# EAGLE design Roll Swarm (EAGLE 9.6.2)
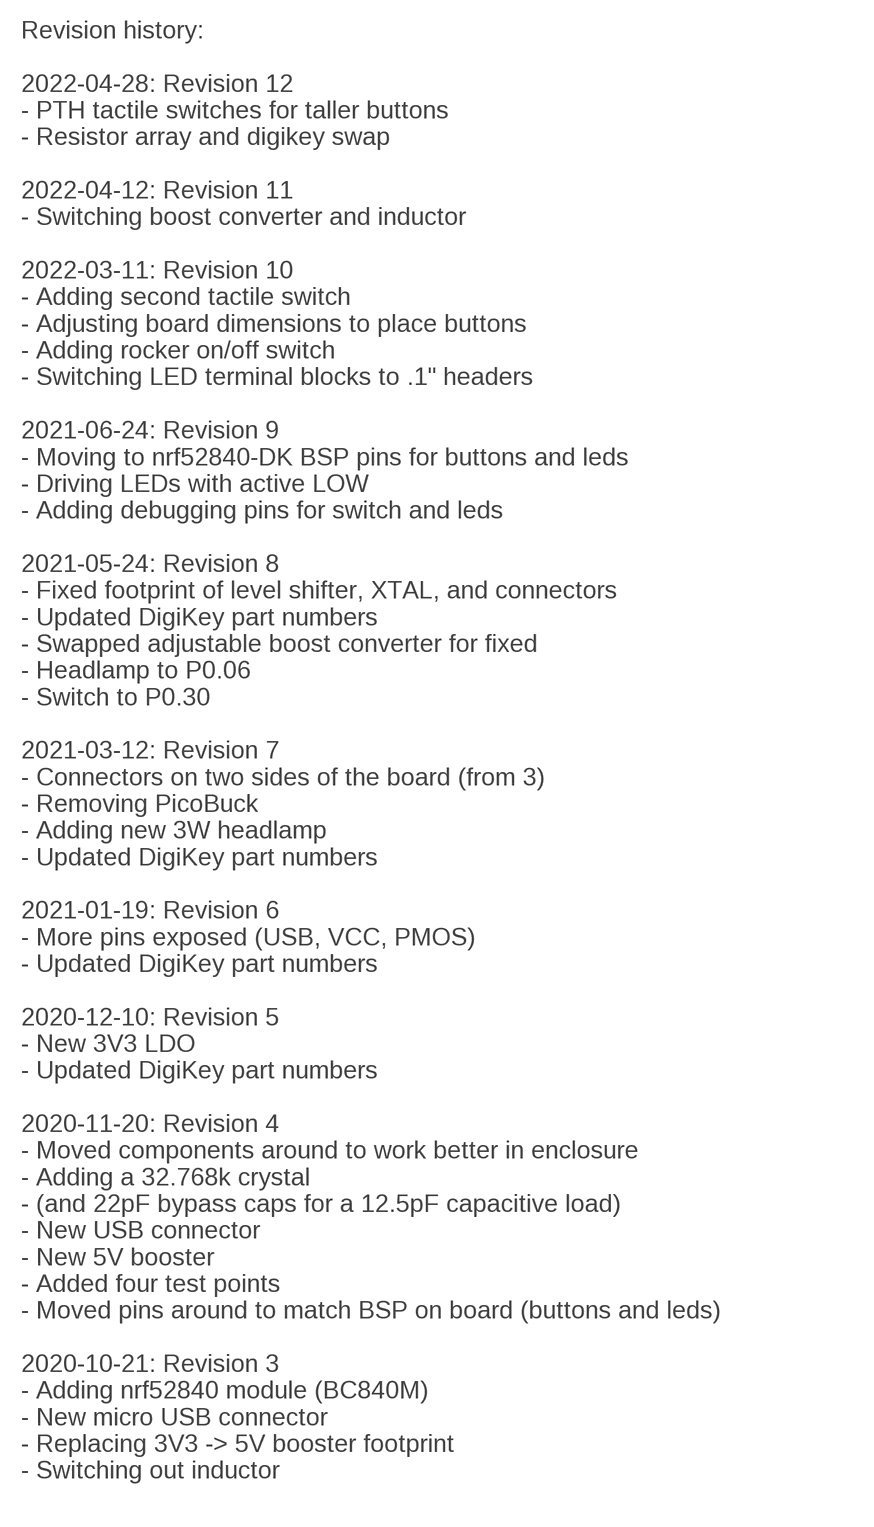
[diagram p0: schematic, sheet 1, part 1 of 2]
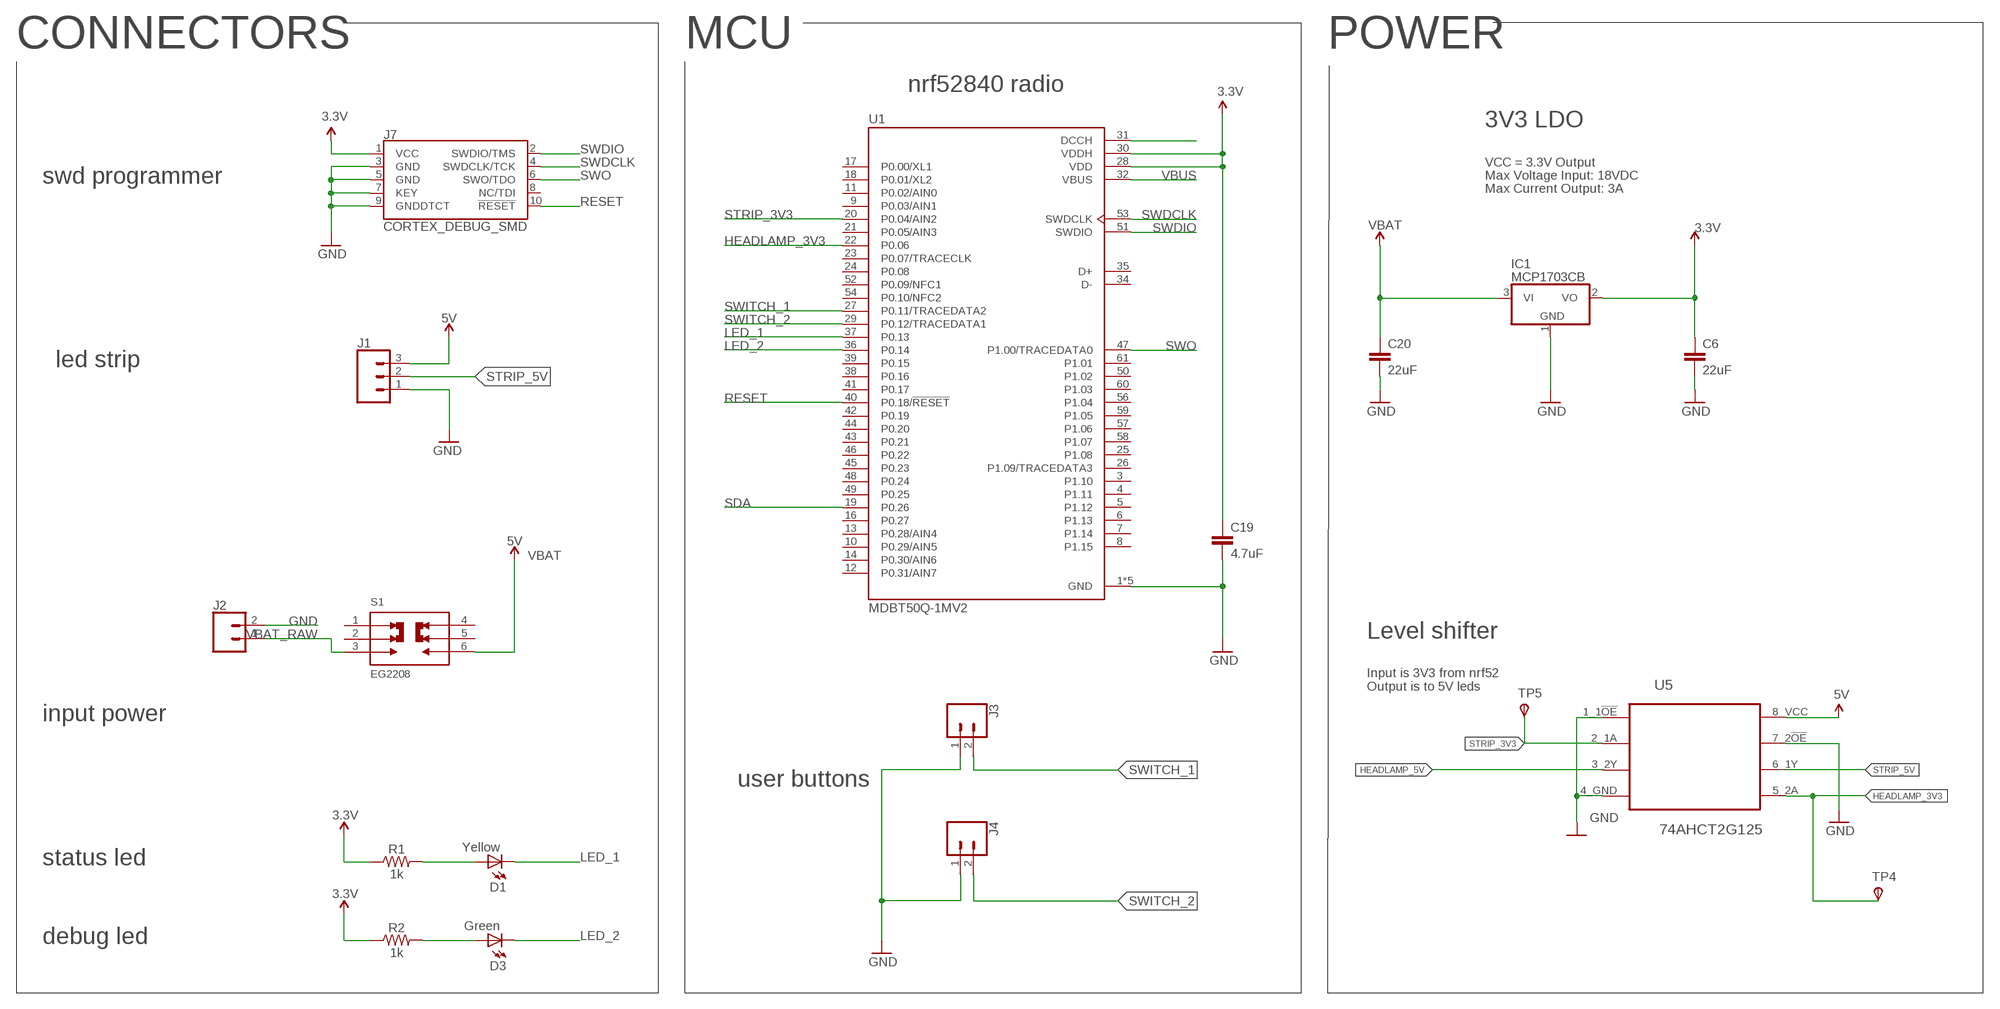
[diagram p1: schematic, sheet 1, part 2 of 2]

## Parts
C6  22uF  22UF-0805-6.3V-20%  [0805]
C19  4.7uF  4.7UF0603  [0603]
C20  22uF  22UF-0805-6.3V-20%  [0805]
D1  Yellow  LED0603  [LED-0603]
D3  Green  LED0603  [LED-0603]
IC1  MCP1703CB  [SOT23]
J1  CONN_03LOCK_LONGPADS  [1X03_LOCK_LONGPADS]
J2  CONN_02LOCK_LONGPADS  [1X02_LOCK_LONGPADS]
J3  CONN_02PTH4  [1X02_XTRA_BIG]
J4  CONN_02PTH4  [1X02_XTRA_BIG]
J7  CORTEX_DEBUG_SMD  [SAMTECH_FTSH-105-01]
R1  1k  1KOHM-0603-1/10W-1%  [0603]
R2  1k  1KOHM-0603-1/10W-1%  [0603]
S1  EG2208  [SW_EG2208]
TP4  TPSB1,27  [B1,27]
TP5  TPSB1,27  [B1,27]
U1  MDBT50Q-1MV2  [XCVR_MDBT50Q-1MV2]
U5  74AHCT2G125  VSSOP-8_DEVICE  [VSSOP-8]

## Nets
3.3V: C6.1 C19.1 IC1.2(VO) J7.1(VCC) R1.1 R2.1 U1.28(VDD) U1.30(VDDH) ; supply symbol labelled VCC
GND: C6.2 C19.2 C20.2 IC1.1(GND) J1.1 J2.2 J3.1 J4.1 J7.3(GND) J7.5(GND) J7.7(KEY) J7.9(GNDDTCT) U1.1(GND) U1.2(GND) U1.15(GND) U1.33(GND) U1.55(GND) U5.1_1!OE U5.4_GND U5.7_2!OE
HEADLAMP_3V3: TP4.TP(PP) U1.22(P0.06) U5.5_2A
HEADLAMP_5V: U5.3_2Y
LED_1: D1.C U1.37(P0.13)
LED_2: D3.C U1.36(P0.14)
N$1: D1.A R1.2
N$5: U1.31(DCCH)
N$8: D3.A R2.2
RESET: J7.10(!RESET) U1.40(P0.18/!RESET)
SDA: U1.19(P0.26)
STRIP_3V3: TP5.TP(PP) U1.20(P0.04/AIN2) U5.2_1A
STRIP_5V: J1.2 U5.6_1Y
SWDCLK: J7.4(SWDCLK/TCK) U1.53(SWDCLK)
SWDIO: J7.2(SWDIO/TMS) U1.51(SWDIO)
SWITCH_1: J3.2 U1.27(P0.11/TRACEDATA2)
SWITCH_2: J4.2 U1.29(P0.12/TRACEDATA1)
SWO: J7.6(SWO/TDO) U1.47(P1.00/TRACEDATA0)
VBAT: C20.1 IC1.3(VI) J1.3 S1.6 U5.8_VCC ; supply symbol labelled 5V
VBAT_RAW: J2.1 S1.3
VBUS: U1.32(VBUS)
Unconnected: J7.8(NC/TDI) S1.1 S1.2 S1.4 S1.5 U1.3(P1.10) U1.4(P1.11) U1.5(P1.12) U1.6(P1.13) U1.7(P1.14) U1.8(P1.15) U1.9(P0.03/AIN1) U1.10(P0.29/AIN5) U1.11(P0.02/AIN0) U1.12(P0.31/AIN7) U1.13(P0.28/AIN4) U1.14(P0.30/AIN6) U1.16(P0.27) U1.17(P0.00/XL1) U1.18(P0.01/XL2) U1.21(P0.05/AIN3) U1.23(P0.07/TRACECLK) U1.24(P0.08) U1.25(P1.08) U1.26(P1.09/TRACEDATA3) U1.34(D-) U1.35(D+) U1.38(P0.16) U1.39(P0.15) U1.41(P0.17) U1.42(P0.19) U1.43(P0.21) U1.44(P0.20) U1.45(P0.23) U1.46(P0.22) U1.48(P0.24) U1.49(P0.25) U1.50(P1.02) U1.52(P0.09/NFC1) U1.54(P0.10/NFC2) U1.56(P1.04) U1.57(P1.06) U1.58(P1.07) U1.59(P1.05) U1.60(P1.03) U1.61(P1.01)

## Notes on the sheet
- Revision history:
  
  2022-04-28: Revision 12
  - PTH tactile switches for taller buttons
  - Resistor array and digikey swap
  
  2022-04-12: Revision 11
  - Switching boost converter and inductor
  
  2022-03-11: Revision 10
  - Adding second tactile switch
  - Adjusting board dimensions to place buttons
  - Adding rocker on/off switch
  - Switching LED terminal blocks to .1" headers
  
  2021-06-24: Revision 9
  - Moving to nrf52840-DK BSP pins for buttons and leds
  - Driving LEDs with active LOW
  - Adding debugging pins for switch and leds
  
  2021-05-24: Revision 8
  - Fixed footprint of level shifter, XTAL, and connectors
  - Updated DigiKey part numbers
  - Swapped adjustable boost converter for fixed
  - Headlamp to P0.06
  - Switch to P0.30
  
  2021-03-12: Revision 7
  - Connectors on two sides of the board (from 3)
  - Removing PicoBuck
  - Adding new 3W headlamp
  - Updated DigiKey part numbers
  
  2021-01-19: Revision 6
  - More pins exposed (USB, VCC, PMOS)
  - Updated DigiKey part numbers
  
  2020-12-10: Revision 5
  - New 3V3 LDO
  - Updated DigiKey part numbers
  
  2020-11-20: Revision 4
  - Moved components around to work better in enclosure
  - Adding a 32.768k crystal 
  - (and 22pF bypass caps for a 12.5pF capacitive load) 
  - New USB connector
  - New 5V booster
  - Added four test points
  - Moved pins around to match BSP on board (buttons and leds)
  
  2020-10-21: Revision 3
  - Adding nrf52840 module (BC840M)
  - New micro USB connector
  - Replacing 3V3 -> 5V booster footprint
  - Switching out inductor
- CONNECTORS | MCU | POWER
- nrf52840 radio
- 3V3 LDO
- swd programmer | VCC = 3.3V Output
- Max Voltage Input: 18VDC
- Max Current Output: 3A
- led strip
- Level shifter
- Input is 3V3 from nrf52
  Output is to 5V leds
- input power
- user buttons
- status led
- debug led

## Library data of the parts
C6 C20 = SparkFun-Capacitors:22UF: 22µF ceramic capacitors A capacitor is a passive two-terminal electrical component used to store electrical energy temporarily in an electric field.; DIGIKEY: 490-10511-1-ND; PROD_ID: CAP-08402
C19 = SparkFun-Capacitors:4.7UF: 4.7µF ceramic capacitors A capacitor is a passive two-terminal electrical component used to store electrical energy temporarily in an electric field.; DIGIKEY: 399-3482-1-ND; PROD_ID: CAP-08280
D1 = SparkFun:LED: LEDs Standard schematic elements and footprints for 5mm, 3mm, 1206, and 0603 sized LEDs. 5mm - Spark Fun Electronics SKU : COM-00529 (and others); DIGIKEY: 350-4349-2-ND
D3 = SparkFun:LED: LEDs Standard schematic elements and footprints for 5mm, 3mm, 1206, and 0603 sized LEDs. 5mm - Spark Fun Electronics SKU : COM-00529 (and others); DIGIKEY: 754-1116-1-ND
IC1 = linear:MCP1703: 250 mA, 16V, Low Quiescent Current LDO Regulator Source: http://ww1.microchip.com/downloads/en/DeviceDoc/22049b.pdf; DIGIKEY: AP2138N-3.3TRG1DICT-ND
J1 = SparkFun-Connectors:CONN_03: Multi connection point. Often used as Generic Header-pin footprint for 0.1 inch spaced/style header connections On any of the 0.1 inch spaced packages, you can populate with these: Break Away Headers - Straight <https://www.sparkfun.com/products/116> (PRT-00116) Break Away Male Headers - Right Angle <https://www.sparkfun.com/products/553> (PRT-00553) Female Headers <https://www.sparkfun.com/products/115> (PRT-00115) Break Away Headers - Machine Pin <https://www.sparkfun.com/products/117> (PRT-00117) Break Away Female Headers - Swiss Machine Pin <https://www.sparkfun.com/products/743> (PRT-00743) Stackable Header - 3 Pin (Female, 0.1") <https://www.sparkfun.com/products/13875> (PRT-13875) For SCREWTERMINALS and SPRING TERMINALS visit here: Screw Terimnals on SparkFun.com <https://www.sparkfun.com/search/results?term=Screw+Terminals> (5mm/3.5mm/2.54mm spacing) This device is also useful as a general connection point to wire up your design to another part of your project. Our various solder wires solder well into these plated through hole pads. Hook-Up Wire - Assortment (Stranded, 22 AWG) <https://www.sparkfun.com/products/11375> (PRT-11375) Hook-Up Wire - Assortment (Solid Core, 22 AWG) <https://www.sparkfun.com/products/11367> (PRT-11367) View the entire wire category on our website here <https://www.sparkfun.com/categories/141> Special notes: Molex polarized connector foot print use with SKU : PRT-08232 with associated crimp pins and housings.; DIGIKEY: S1111EC-03-ND
J2 = SparkFun-Connectors:CONN_02: Multi connection point. Often used as Generic Header-pin footprint for 0.1 inch spaced/style header connections On any of the 0.1 inch spaced packages, you can populate with these: Break Away Headers - Straight <https://www.sparkfun.com/products/116> (PRT-00116) Break Away Male Headers - Right Angle <https://www.sparkfun.com/products/553> (PRT-00553) Female Headers <https://www.sparkfun.com/products/115> (PRT-00115) Break Away Headers - Machine Pin <https://www.sparkfun.com/products/117> (PRT-00117) Break Away Female Headers - Swiss Machine Pin <https://www.sparkfun.com/products/743> (PRT-00743) For SCREWTERMINALS and SPRING TERMINALS visit here: Screw Terimnals on SparkFun.com <https://www.sparkfun.com/search/results?term=Screw+Terminals> (5mm/3.5mm/2.54mm spacing) This device is also useful as a general connection point to wire up your design to another part of your project. Our various solder wires solder well into these plated through hole pads. Hook-Up Wire - Assortment (Stranded, 22 AWG) <https://www.sparkfun.com/products/11375> (PRT-11375) Hook-Up Wire - Assortment (Solid Core, 22 AWG) <https://www.sparkfun.com/products/11367> (PRT-11367) View the entire wire category on our website here <https://www.sparkfun.com/categories/141> Special notes: Molex polarized connector foot print use with: PRT-08233 with associated crimp pins and housings. 2.54_SCREWTERM for use with PRT-10571. 3.5mm Screw Terminal footprints for PRT-08084 5mm Screw Terminal footprints for use with PRT-08432; DIGIKEY: S1111EC-02-ND
J3 J4 = SparkFun-Connectors:CONN_02: Multi connection point. Often used as Generic Header-pin footprint for 0.1 inch spaced/style header connections On any of the 0.1 inch spaced packages, you can populate with these: Break Away Headers - Straight <https://www.sparkfun.com/products/116> (PRT-00116) Break Away Male Headers - Right Angle <https://www.sparkfun.com/products/553> (PRT-00553) Female Headers <https://www.sparkfun.com/products/115> (PRT-00115) Break Away Headers - Machine Pin <https://www.sparkfun.com/products/117> (PRT-00117) Break Away Female Headers - Swiss Machine Pin <https://www.sparkfun.com/products/743> (PRT-00743) For SCREWTERMINALS and SPRING TERMINALS visit here: Screw Terimnals on SparkFun.com <https://www.sparkfun.com/search/results?term=Screw+Terminals> (5mm/3.5mm/2.54mm spacing) This device is also useful as a general connection point to wire up your design to another part of your project. Our various solder wires solder well into these plated through hole pads. Hook-Up Wire - Assortment (Stranded, 22 AWG) <https://www.sparkfun.com/products/11375> (PRT-11375) Hook-Up Wire - Assortment (Solid Core, 22 AWG) <https://www.sparkfun.com/products/11367> (PRT-11367) View the entire wire category on our website here <https://www.sparkfun.com/categories/141> Special notes: Molex polarized connector foot print use with: PRT-08233 with associated crimp pins and housings. 2.54_SCREWTERM for use with PRT-10571. 3.5mm Screw Terminal footprints for PRT-08084 5mm Screw Terminal footprints for use with PRT-08432
J7 = SparkFun-Connectors:CORTEX_DEBUG: Cortex Debug Connector - 10 pin Supports JTAG debug, Serial Wire debug, and Serial Wire Viewer. PTH and SMD connector options available. General Connector Information <http://infocenter.arm.com/help/topic/com.arm.doc.faqs/attached/13634/cortex_debug_connectors.pdf> Products: PTH Connector <http://www.digikey.com/product-detail/en/cnc-tech/3220-10-0100-00/1175-1627-ND/3883661> -via Digi-Key SparkFun PSoc <https://www.sparkfun.com/products/13229> SparkFun T <https://www.sparkfun.com/products/13810>; DIGIKEY: SAM1161-05-ND
R1 R2 = SparkFun-Resistors:1KOHM: 1kΩ resistor A resistor is a passive two-terminal electrical component that implements electrical resistance as a circuit element. Resistors act to reduce current flow, and, at the same time, act to lower voltage levels within circuits. - Wikipedia; DIGIKEY: RNCP0603FTD1K00CT-ND; PROD_ID: RES-07856
S1 = EG2208:EG2208: Check availability <https://pricing.snapeda.com/parts/EG2208/E-Switch/view-part?ref=eda>; AVAILABILITY: In Stock; DESCRIPTION: 2P2T Sub-miniature Slide Switch; MF: E-Switch; MP: EG2208; PACKAGE: None; PRICE: None; PURCHASE-URL: https://pricing.snapeda.com/search?q=EG2208&ref=eda
TP4 TP5 = testpad:TPS: TEST PIN
U1 = MDBT50Q-1MV2:MDBT50Q-1MV2: Embedded 2.4GHz transceiver support Bluetooth V5.0 and 802.15.4 Check availability <https://pricing.snapeda.com/parts/MDBT50Q-1MV2/Raytac%20Corporation/view-part?ref=eda>; AVAILABILITY: In Stock; DESCRIPTION: 802.15.4, Bluetooth Bluetooth v5.2, Zigbee® Transceiver Module 2.36GHz ~ 2.5GHz Integrated, Chip Surface Mount; MF: Raytac Corporation; MP: MDBT50Q-1MV2; PACKAGE: SMD-61 Raytac Corporation; PRICE: None; PURCHASE-URL: https://pricing.snapeda.com/search?q=MDBT50Q-1MV2&ref=eda
U5 = VSSOP8:VSSOP-8_DEVICE: Dual bidirectional I2C-bus and SMBus voltage-level translator; DIGIKEY: 1727-6544-1-ND‎; MPN: PCA9306DC,125; OC_FARNELL: -; OC_NEWARK: 70R6429; PACKAGE: VSSOP-8; SUPPLIER: NXP

## Net classes
0 default: width 0.127 mm, drill 0.305 mm, clearance 0.152 mm
1 power: width 0.508 mm

## Board
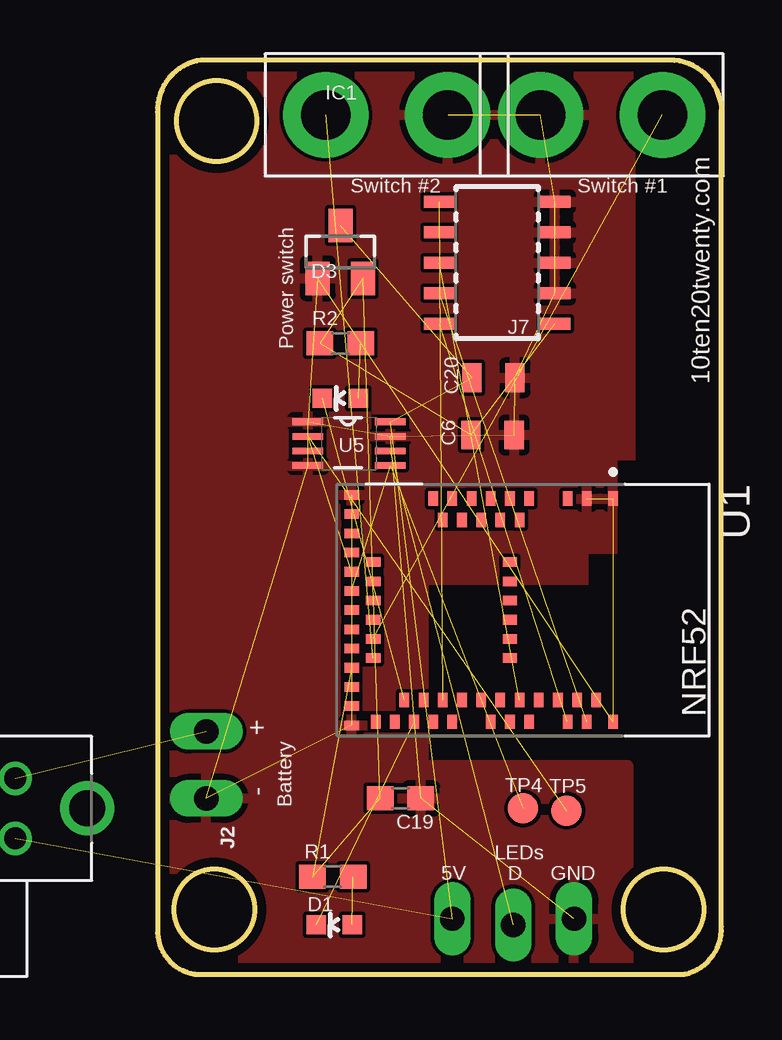
[diagram p2: board, top side]
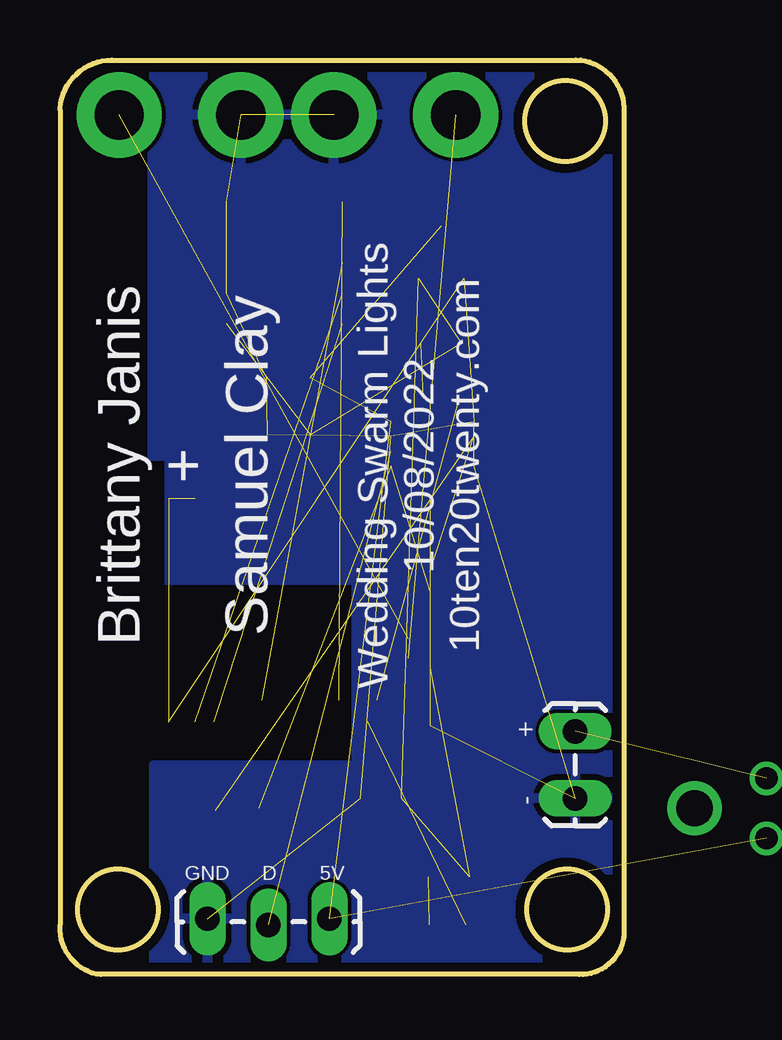
[diagram p3: board, bottom side, seen from below]

Size 23.52 x 38.1 mm. Coordinates in mm from the lower left corner, seen from the top.
Outline: 0,35.93 0,1.72 arc90 1.88,0 21.8,0 21.99,0.01 arc85 23.5,2.17 23.5,35.93 23.52,36.09 arc85 21.36,38.1 2.01,38.1 1.82,38.09 arc85 0,35.93
Outline: circle at 2.37,2.7 radius 1.68
Outline: circle at 2.46,35.56 radius 1.68
Outline: circle at 21.1,2.7 radius 1.68
Copper layers (1*16): Top 0.035559375mm / dielectric 1.6mm / Bottom 0.035559375mm
Design rules "oshpark-2layer-tented": minimum track width 6mil, minimum drill 10mil, track to track 6mil, track to pad 6mil, pad to pad 6mil, via to via 6mil, smd to smd 6mil, copper to edge 15mil, drill to drill 6mil, minimum pad ring 5mil, minimum via ring 5mil, stop-mask expansion 2.5mil, vias tented up to drill 20mil, thermal gap 10mil

### Footprints (pad centres in the part's own frame; a part is rotated, then mirrored left to right if it is on the bottom)
0805 = smd 0.8 x 1.2: 1 -0.9,0; 2 0.9,0
0603 = smd 1.1 x 1: 1 -0.85,0; 2 0.85,0
LED-0603 = smd 0.8 x 0.8: A 0,-0.75; C 0,0.75
SOT23 = smd 1 x 1.4: 1 -0.95,-1.1; 2 0.95,-1.1; 3 0,1.1
1X03_LOCK_LONGPADS = drill 1.016 long: 1 0,0; 2 2.54,-0.254; 3 5.08,0
1X02_LOCK_LONGPADS = drill 1.016 long: 1 -0.127,0; 2 2.667,0
1X02_XTRA_BIG = drill 2.057 pad 3.556: 1 -2.54,0; 2 2.54,0
SAMTECH_FTSH-105-01 = smd 0.508 x 1.27: 1 -2.54,-2.413; 2 -2.54,2.413; 3 -1.27,-2.413; 4 -1.27,2.413; 5 0,-2.413; 6 0,2.413; 7 1.27,-2.413; 8 1.27,2.413; 9 2.54,-2.413; 10 2.54,2.413
SW_EG2208 = drill 0.93 square: 1 -2,1.25 | drill 0.93: 2 0,1.25; 3 2,1.25; 4 -2,-1.25; 5 0,-1.25; 6 2,-1.25 | drill 1.51: S1 -5,0; S2 5,0
B1,27 = smd 1.27 x 1.27: TP 0,0
XCVR_MDBT50Q-1MV2 = smd 0.6 x 0.4: 1 -4.65,3.75; 2 -4.65,2.65; 3 -4.65,1.85; 4 -4.65,0.25; 5 -3.75,-0.15; 6 -4.65,-0.55; 7 -3.75,-0.95; 8 -4.65,-1.35; 9 -3.75,-1.75; 10 -4.65,-2.15; 11 -3.75,-2.55; 12 -4.65,-2.95; 13 -3.75,-3.35; 14 -4.65,-3.75; 34 4.65,-6.15; 35 4.65,-5.35; 36 3.75,-4.95; 37 4.65,-4.55; 38 3.75,-4.15; 39 4.65,-3.75; 40 3.75,-3.35; 41 4.65,-2.95; 42 3.75,-2.55; 43 3.75,-1.75; 44 4.65,-1.35; 45 3.75,-0.95; 46 4.65,-0.55; 47 3.75,-0.15; 48 4.65,0.25; 49 3.75,0.65; 50 3.75,1.45; 51 4.65,1.85; 52 3.75,2.25; 53 4.65,2.65; 54 3.75,3.05; 55 4.65,3.75 | smd 0.4 x 0.6: 15 -4.8,-7.15; 16 -4,-7.15; 17 -3.2,-7.15; 18 -2.4,-7.15; 19 -2,-6.25; 20 -1.6,-7.15; 21 -1.2,-6.25; 22 -0.8,-7.15; 23 -0.4,-6.25; 24 0,-7.15; 25 0.4,-6.25; 26 0.8,-7.15; 27 1.2,-6.25; 28 1.6,-7.15; 29 2,-6.25; 30 2.4,-7.15; 31 3.2,-7.15; 32 4,-7.15; 33 4.8,-7.15; 56 -2,-0.55; 57 -1.2,-0.55; 58 -0.4,-0.55; 59 0.4,-0.55; 60 1.2,-0.55; 61 2,-0.55
VSSOP-8 = smd 1.27 x 0.279: 1_1!OE -1.673,0.862; 2_1A -1.673,0.254; 3_2Y -1.673,-0.354; 4_GND -1.673,-0.962; 5_2A 1.773,-0.962; 6_1Y 1.773,-0.354; 7_2!OE 1.773,0.254; 8_VCC 1.773,0.862

### Placement (x,y rotation side)
C6  13.97,22.48 0 top
C19  10.13,7.33 0 top
C20  14,24.86 0 top
D1  7.37,2.06 90 top
D3  7.62,24 90 top
IC1  7.62,30.1 0 top
J1  17.37,2.32 0 bottom
J2  2.03,10 270 bottom
J3  18.51,35.81 0 top
J4  9.56,35.81 180 top
J7  14.16,29.65 90 top
R1  7.3,4.06 0 top
R2  7.62,26.29 0 top
S1  -7.94,6.92 0 top
TP4  15.24,6.92 0 top
TP5  17.05,6.83 0 top
U1  15.24,15.18 270 top
U5  7.94,22.16 0 top

### Tracks (layer width: path | path; a pad name or v marks a point on that pad's centre or on a via)
3.3V  (7 unrouted)
GND  (19 unrouted)
  pour Top (isolate 0.005): -0.32,38.67 19.72,38.67 19.72,16.41 11.08,16.41 11.08,8.73 19.62,8.73 19.62,-0.38 -0.32,-0.38
  pour Bottom (isolate 0.005): -0.63,38.67 19.68,38.67 19.68,16.45 11.18,16.45 11.18,8.7 19.62,8.7 19.62,-0.06 -0.63,-0.06
HEADLAMP_3V3  (2 unrouted)
LED_1  (1 unrouted)
LED_2  (1 unrouted)
N$1  (1 unrouted)
N$8  (1 unrouted)
RESET  (1 unrouted)
STRIP_3V3  (2 unrouted)
STRIP_5V  (1 unrouted)
SWDCLK  (1 unrouted)
SWDIO  (1 unrouted)
SWITCH_1  (1 unrouted)
SWITCH_2  (1 unrouted)
SWO  (1 unrouted)
VBAT  (4 unrouted)
VBAT_RAW  (1 unrouted)

### Text on the board
tPlace: Switch #2 | Switch #1 | Power switch | 10ten20twenty.com | + | NRF52 | - | Battery | LEDs | 5V | D | GND
bPlace: Wedding Swarm Lights / 10/08/2022 / 10ten20twenty.com | Brittany Janis / + / Samuel Clay | + | - | 5V | D | GND